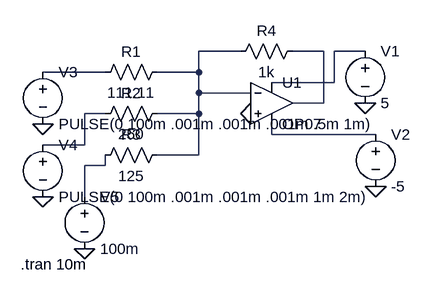
[diagram p0: schematic and_with_positive_weight.asc]
and_with_positive_weight.asc, the LTspice schematic file:
Version 4
SHEET 1 880 680
WIRE 208 64 144 64
WIRE 336 64 288 64
WIRE 400 64 352 64
WIRE 0 96 -96 96
WIRE 144 96 144 64
WIRE 144 96 80 96
WIRE 352 112 352 64
WIRE 352 112 256 112
WIRE 144 128 144 96
WIRE 224 128 144 128
WIRE 336 144 336 64
WIRE 336 144 288 144
WIRE 0 160 -32 160
WIRE 144 160 144 128
WIRE 144 160 80 160
WIRE 256 192 256 176
WIRE 416 192 256 192
WIRE -32 208 -32 160
WIRE -32 208 -96 208
WIRE 144 224 144 160
WIRE 144 224 80 224
WIRE 0 240 0 224
WIRE 0 240 -32 240
WIRE -32 288 -32 240
FLAG 224 160 0
FLAG -96 176 0
FLAG -96 288 0
FLAG -32 368 0
FLAG 416 272 0
FLAG 400 144 0
SYMBOL res 96 80 R90
WINDOW 0 0 56 VBottom 2
WINDOW 3 32 56 VTop 2
SYMATTR InstName R1
SYMATTR Value 111.11
SYMBOL res 96 144 R90
WINDOW 0 0 56 VBottom 2
WINDOW 3 32 56 VTop 2
SYMATTR InstName R2
SYMATTR Value 250
SYMBOL res 96 208 R90
WINDOW 0 0 56 VBottom 2
WINDOW 3 32 56 VTop 2
SYMATTR InstName R3
SYMATTR Value 125
SYMBOL res 304 48 R90
WINDOW 0 0 56 VBottom 2
WINDOW 3 32 56 VTop 2
SYMATTR InstName R4
SYMATTR Value 1k
SYMBOL Opamps\\OP07 256 80 R0
SYMATTR InstName U1
SYMBOL voltage 400 48 R0
WINDOW 123 0 0 Left 2
WINDOW 39 0 0 Left 2
SYMATTR InstName V1
SYMATTR Value 5
SYMBOL voltage 416 176 R0
WINDOW 123 0 0 Left 2
WINDOW 39 0 0 Left 2
SYMATTR InstName V2
SYMATTR Value -5
SYMBOL voltage -96 80 R0
WINDOW 123 0 0 Left 2
WINDOW 39 0 0 Left 2
SYMATTR InstName V3
SYMATTR Value PULSE(0 100m .001m .001m .001m .5m 1m)
SYMBOL voltage -96 192 R0
WINDOW 123 0 0 Left 2
WINDOW 39 0 0 Left 2
SYMATTR InstName V4
SYMATTR Value PULSE(0 100m .001m .001m .001m 1m 2m)
SYMBOL voltage -32 272 R0
WINDOW 123 0 0 Left 2
WINDOW 39 0 0 Left 2
SYMATTR InstName V5
SYMATTR Value 100m
TEXT -130 392 Left 2 !.tran 10m

The netlist it stands for:
* and_with_positive_weight.asc
R1 N001 N004 111.11
R2 N001 N005 250
R3 N001 N007 125
R4 N002 N001 1k
XU1 0 N001 N003 N006 N002 LT1001  ; OP07, pins In+ In- V+ V- OUT
V1 N003 0 5
V2 N006 0 -5
V3 N004 0 PULSE(0 100m .001m .001m .001m .5m 1m)
V4 N005 0 PULSE(0 100m .001m .001m .001m 1m 2m)
V5 N007 0 100m
.tran 10m
.lib LTC.lib
.backanno
.end